# EAGLE design DaFunc (EAGLE 7.1.0)
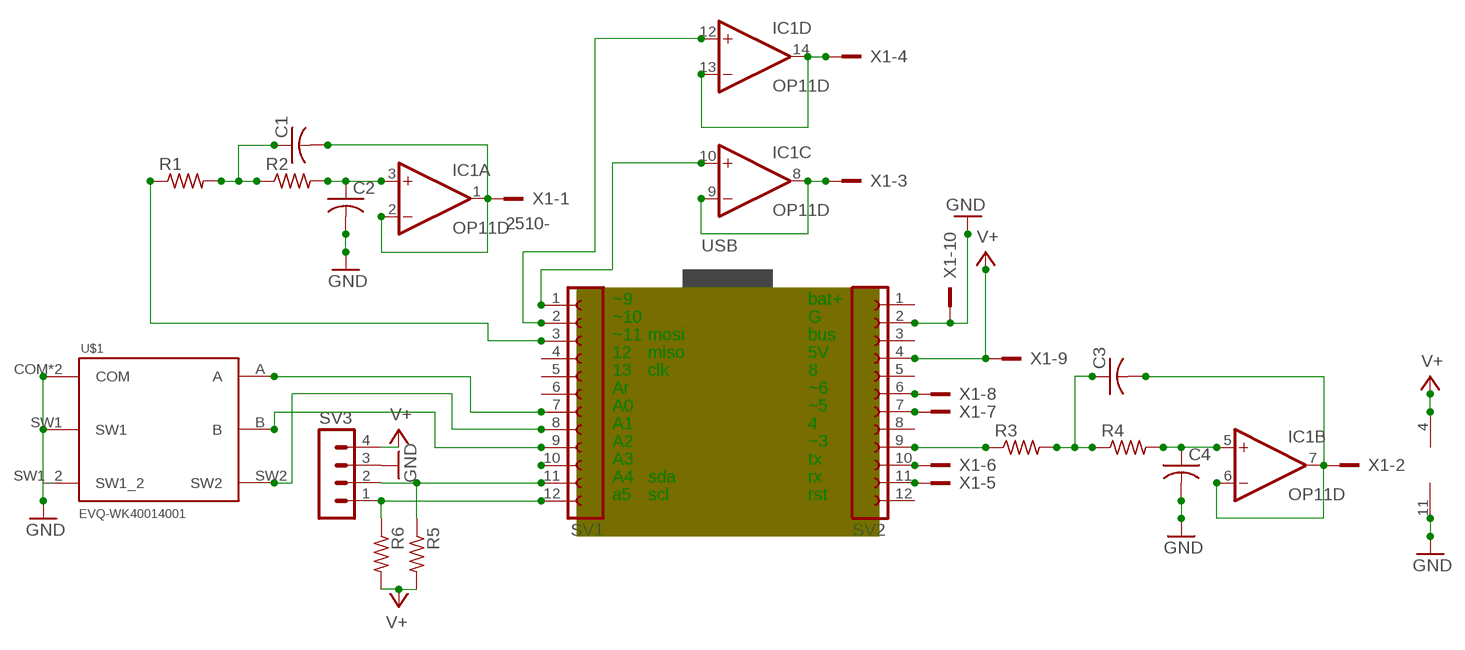
[diagram p0: schematic, sheet 1]

## Parts
C1  C-USC0603  [C0603]
C2  C-USC0603  [C0603]
C3  C-USC0603  [C0603]
C4  C-USC0603  [C0603]
IC1  OP11D  [SO14]
R1  R-US_R0603  [R0603]
R2  R-US_R0603  [R0603]
R3  R-US_R0603  [R0603]
R4  R-US_R0603  [R0603]
R5  R-US_R0603  [R0603]
R6  R-US_R0603  [R0603]
SV1  FE12-1  [FE12]
SV2  FE12-1  [FE12]
SV3  MA04-1  [MA04-1]
U$1  EVQ-WK40014001  [WK4]
X1  2510-  [PAK100/2500-10]

## Nets
GND: C2.2 C4.2 IC1.11(P:V-) SV2.2 SV3.3 U$1.COM U$1.GND(COM) U$1.SW1 U$1.SW1_2 X1.10
N$1: C1.1 R1.2 R2.1
N$2: C2.1 IC1.3(A:+IN) R2.2
N$3: R6.1 SV1.12 SV3.1
N$4: R5.1 SV1.11 SV3.2
N$5: SV1.10
N$6: SV1.9 U$1.B
N$7: SV1.8 U$1.SW2
N$8: SV1.7 U$1.A
N$11: R1.1 SV1.3
N$12: IC1.10(C:+IN) SV1.1
N$15: SV2.11 X1.5
N$16: SV2.10 X1.6
N$18: R3.1 SV2.9
N$19: SV2.7 X1.7
N$20: SV2.6 X1.8
N$21: C4.1 IC1.5(B:+IN) R4.2
N$22: C3.1 R3.2 R4.1
N$23: IC1.8(C:OUT) IC1.9(C:-IN) X1.3
N$24: C3.2 IC1.6(B:-IN) IC1.7(B:OUT) X1.2
N$25: C1.2 IC1.1(A:OUT) IC1.2(A:-IN) X1.1
N$26: IC1.13(D:-IN) IC1.14(D:OUT) X1.4
N$27: IC1.12(D:+IN) SV1.2
V+: IC1.4(P:V+) R5.2 R6.2 SV2.4 SV3.4 X1.9
Unconnected: SV1.4 SV1.5 SV1.6 SV2.1 SV2.3 SV2.5 SV2.8 SV2.12

## Notes on the sheet
- USB
- USB | USB | USB
- ~9 | bat+
- ~10 | G
- ~11 | mosi | bus
- 12 | miso | 5V
- 13 | clk | 8
- Ar | ~6
- A0 | ~5
- A1 | 4
- A2 | ~3
- A3 | tx
- A4 | sda | rx
- a5 | scl | rst

## Library data of the parts
C1-C4 = rcl:C-US: CAPACITOR, American symbol
IC1 = linear:OP11: Quad Low-Offset Low-Power OP AMP The OP-11 is pin compatible with the OP-400 , LM148, HA4741, RM4156, and LT1014 operational amplifiers source http://products.analog.com/products/info.asp?product=OP400
R1-R6 = rcl:R-US_: RESISTOR, American symbol
SV1 SV2 = con-lsta:FE12-1: FEMALE HEADER; OC_FARNELL: unknown; OC_NEWARK: unknown
SV3 = con-lstb:MA04-1: PIN HEADER; OC_FARNELL: unknown; OC_NEWARK: unknown
U$1 = trinket-gannon:EVQ-WK4001
X1 = con-3m:2510-: 3M (TM) Pak 100 4-Wall Header Source: 3M; MF: 3M; MPN: 2510-6002UB; OC_FARNELL: 9838244; OC_NEWARK: 46F4725

## Board
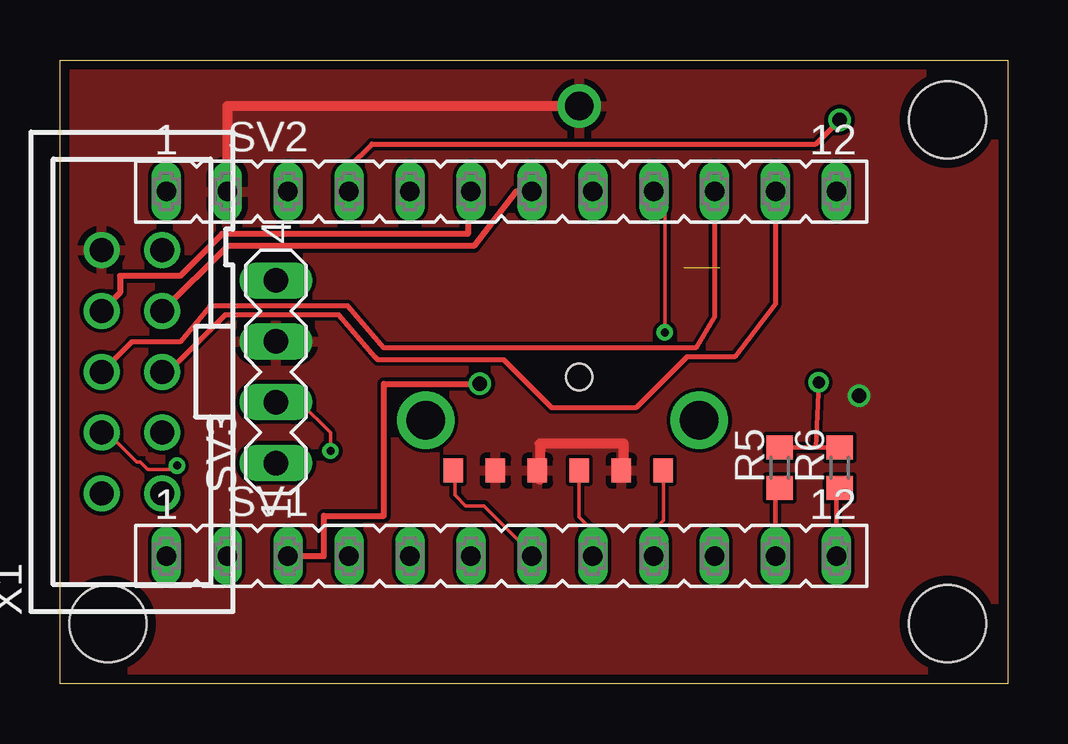
[diagram p1: board, top side]
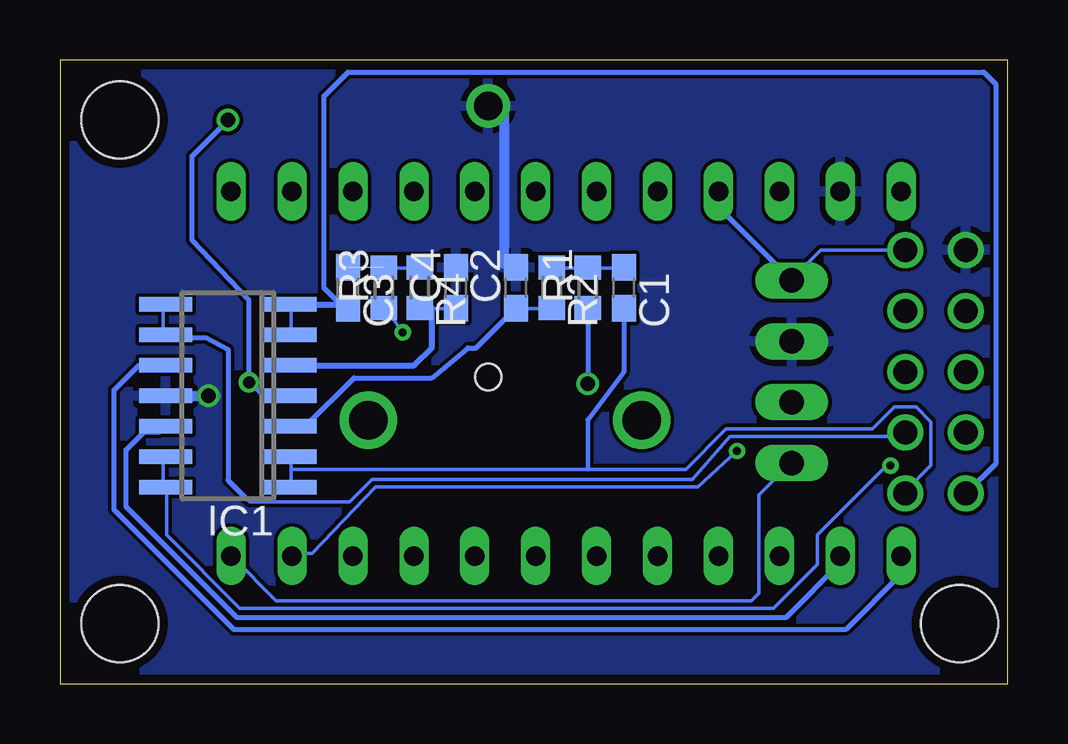
[diagram p2: board, bottom side, seen from below]

Size 39.5 x 26 mm. Coordinates in mm from the lower left corner, seen from the top.
Outline: 0,26 39.5,26 39.5,0 0,0 0,26
Copper layers (1*16): Top 0.0356mm / dielectric 1.5011mm / Bottom 0.0356mm
Design rules "LaenPCBOrder": minimum track width 6mil, minimum drill 13mil, track to track 6mil, track to pad 6mil, pad to pad 6mil, via to via 6mil, smd to smd 6mil, copper to edge 15mil, drill to drill 6mil, minimum pad ring 7mil, minimum via ring 7mil, stop-mask expansion 3mil, vias tented up to drill 0mil, thermal gap 10mil
Holes 3.2 mm at 37,23.5 37,2.5 2,2.5

### Footprints (pad centres in the part's own frame; a part is rotated, then mirrored left to right if it is on the bottom)
C0603 = smd 1.1 x 1: 1 -0.85,0; 2 0.85,0
SO14 = smd 0.6 x 2.2: 1 -3.81,-2.6; 2 -2.54,-2.6; 3 -1.27,-2.6; 4 0,-2.6; 5 1.27,-2.6; 6 2.54,-2.6; 7 3.81,-2.6; 8 3.81,2.6; 9 2.54,2.6; 10 1.27,2.6; 11 0,2.6; 12 -1.27,2.6; 13 -2.54,2.6; 14 -3.81,2.6
R0603 = smd 1 x 1.1: 1 -0.85,0; 2 0.85,0
FE12 = drill 0.813 long: 1 -13.97,0; 2 -11.43,0; 3 -8.89,0; 4 -6.35,0; 5 -3.81,0; 6 -1.27,0; 7 1.27,0; 8 3.81,0; 9 6.35,0; 10 8.89,0; 11 11.43,0; 12 13.97,0
MA04-1 = drill 1.016 long: 1 -3.81,0; 2 -1.27,0; 3 1.27,0; 4 3.81,0
WK4 = smd 1 x 0.813: A -0.9,5.25; B -0.9,-3.5; COM -0.9,3.5; SW1 -0.9,1.75; SW1_2 -0.9,-1.75; SW2 -0.9,0 | drill 1.2: GND 14.3,0 | drill 1.6: P$2 1.2,-5; P$3 1.2,6.4 | hole 1.1: 3,0
PAK100/2500-10 = drill 1 pad 1.422: 1 -5.08,-1.27; 2 -5.08,1.27; 3 -2.54,-1.27; 4 -2.54,1.27; 5 0,-1.27; 6 0,1.27; 7 2.54,-1.27; 8 2.54,1.27; 9 5.08,-1.27; 10 5.08,1.27

### Placement (x,y rotation side)
C1  16,16.5 270 bottom
C2  20.5,16.5 90 bottom
C3  27.5,16.5 270 bottom
C4  23,16.5 90 bottom
IC1  32.5,12 90 bottom
R1  17.5,16.5 90 bottom
R2  19,16.5 270 bottom
R3  26,16.5 90 bottom
R4  24.5,16.5 270 bottom
R5  30,9 90 top
R6  32.5,9 90 top
SV1  18.4,5.32 0 top
SV2  18.4,20.52 0 top
SV3  9,13 90 top
U$1  21.65,9.78 90 top
X1  3,13 90 top

### Tracks (layer width: path | path; a pad name or v marks a point on that pad's centre or on a via)
GND  (via drill 0.6)
  Top 0.406: U$1.GND 6.97,24.08 SV2.2 | U$1.SW1_2 23.5,8.88 23.5,10 20,10 20,8.5
  Bottom 0.406: U$1.GND 21,24.08 21,17.5 20.5,17.5 C2.2 | IC1.11 v33.31,12 33,12
  pour Bottom: 0,26 39.5,26 39.5,0 0,0
  pour Top: 0,26.5 39.5,26.5 39.5,0 0,0
N$1
  Bottom 0.152: R1.2 16,17.32 17.37,17.32 C1.1 17.53,17.32 18.9,17.32 R2.1
N$2
  Bottom 0.152: R2.2 19.05,15.64 20.42,15.64 C2.1
  Bottom 0.2: 30.73,10.73 IC1.3 29.27,10.73 27.25,12.75 24,12.75 22.5,14 22.15,14 C2.1
N$3
  Top 0.18: R6.1 32.37,8.15 SV1.12
  Bottom 0.152: SV1.12 32.31,5.28 30.48,3.45 10.67,3.45 10.36,3.75 10.36,7.87 9.14,9.09 SV3.1
N$4  (via drill 0.33)
  Top 0.152: v11.28,9.7 11.28,10.46 10.06,11.68 9.14,11.68 SV3.2
  Top 0.18: R5.1 29.83,8.15 SV1.11
  Bottom 0.152: v11.28,9.7 12.9,8.2 26.34,8.2 28.98,5.43 29.72,5.43 SV1.11
N$6
  Top 0.152: U$1.B 25.15,8.78 25.15,6.8 24.84,6.5 24.84,5.43 SV1.9
N$7
  Top 0.152: U$1.SW2 21.64,8.78 21.64,6.95 22.1,6.5 22.1,5.43 SV1.8
N$8
  Top 0.152: U$1.A 16.46,8.78 16.46,7.87 16.92,7.41 17.68,7.41 19.66,5.43 SV1.7
N$11  (via drill 0.6)
  Top 0.25: 13.5,12.5 v17.5,12.5
  Top 0.254: SV1.3 11,5.32 11,7 13.5,7 13.5,12.5
  Bottom 0.2: R1.1 v17.5,12.5
N$12
  Bottom 0.2: SV1.1 4.43,4.57 6.75,2.25 32.25,2.25 37.25,7.25 37.25,12.25 36.25,13.25 35.12,13.25 IC1.10
N$15
  Top 0.2: SV2.11 29.83,15.83 28.12,13.62 26.12,13.62 24,11.5 20.5,11.5 18.5,13.5 13.25,13.5 13.12,13.62 11.62,15.38 6.88,15.38 4.75,13.25 4.52,13.25 X1.5
N$16
  Top 0.2: SV2.10 27.29,15.29 26.5,14 13.5,14 12,15.75 6.25,15.75 5,14.25 2.98,14.25 X1.6
N$18  (via drill 0.33)
  Top 0.152: v25.22,14.64 25.22,20.33 SV2.9
  Bottom 0.152: v25.22,14.64 25.91,15.64 R3.1
N$19
  Top 0.254: SV2.7 19.02,20.52 17.25,18.25 6.98,18.25 X1.7
N$20
  Top 0.254: SV2.6 17,20.52 17,18.75 6.75,18.75 5,17 2.5,17 2.5,16.31 X1.8
N$21
  Bottom 0.152: C4.1 23.01,15.64 24,15.64 24.38,15.64 R4.2
  Bottom 0.254: IC1.5 24.73,13.27 24,14 24,15.64
N$22  (1 unrouted)
  Bottom 0.152: R4.1 24.54,17.32 25.91,17.32 R3.2
N$23
  Bottom 0.152: IC1.8 35.2,15.79 35.2,14.57 IC1.9 35.05,14.42 34.44,14.42 | 31.74,7.72 31.59,7.56 27.43,7.56 26.49,8.51 13.13,8.51 11.58,10.31 4.57,10.31 4.42,10.46 X1.3
  Bottom 0.2: 34.44,14.42 33.42,14.42 32.5,13.94 32.5,8.47 31.74,7.72
N$24
  Bottom 0.152: IC1.7 29.87,15.79 29.87,14.57 IC1.6 30.02,14.42
  Bottom 0.2: C3.2 27.65,15.65 28.5,16.5 28.5,24.5 27.5,25.5 1,25.5 0.5,25 0.5,9.15 X1.2
  Bottom 0.254: 29.87,15.79 27.64,15.79 C3.2
N$25
  Bottom 0.152: 29.87,8.94 29.87,9.39 IC1.2 | 29.87,8.94 29.87,8.33 IC1.1 | 29.87,8.94 17.5,8.94 13.41,8.94 11.73,10.61 5.64,10.61 4.72,11.53 3.81,11.53 3.2,10.92 3.2,9.09 4.27,8.02 X1.1
  Bottom 0.18: 17.5,8.94 17.5,11
  Bottom 0.2: C1.2 16,13 17.5,11
N$26  (via drill 0.33)
  Top 0.152: v4.88,9.09 4.72,8.94 3.66,8.94 3.35,9.24 3.2,9.24 1.83,10.61 X1.4
  Bottom 0.152: IC1.13 35.2,9.39 35.2,8.33 IC1.14 35.05,8.17 35.05,6.19 32,3.14 9.75,3.14 7.92,4.97 7.92,6.19 5.03,9.09 v4.88,9.09
N$27
  Bottom 0.2: SV1.2 6.97,5.03 9.25,2.75 32.12,2.75 36.75,7.38 36.75,9.75 36,10.5 35.33,10.5 IC1.12
V+  (via drill 0.5 pad 0.25, 0.6)
  Top 0.18: R6.2 R5.2 31.5,9.85 v31.62,12.56
  Top 0.2: SV2.4 12.05,21.55 13,22.5 31.5,22.5 v32.5,23.5
  Bottom 0.152: X1.9 4.42,18.08 7.77,18.08 8.99,16.86 SV3.4
  Bottom 0.2: IC1.4 31,12 v31.62,12.56 31.62,16 34,18.5 34,22 v32.5,23.5 | SV2.4 12.05,19.86 SV3.4